# EAGLE design H1DR51 (EAGLE 9.6.1)

## Sheet 1 of 2
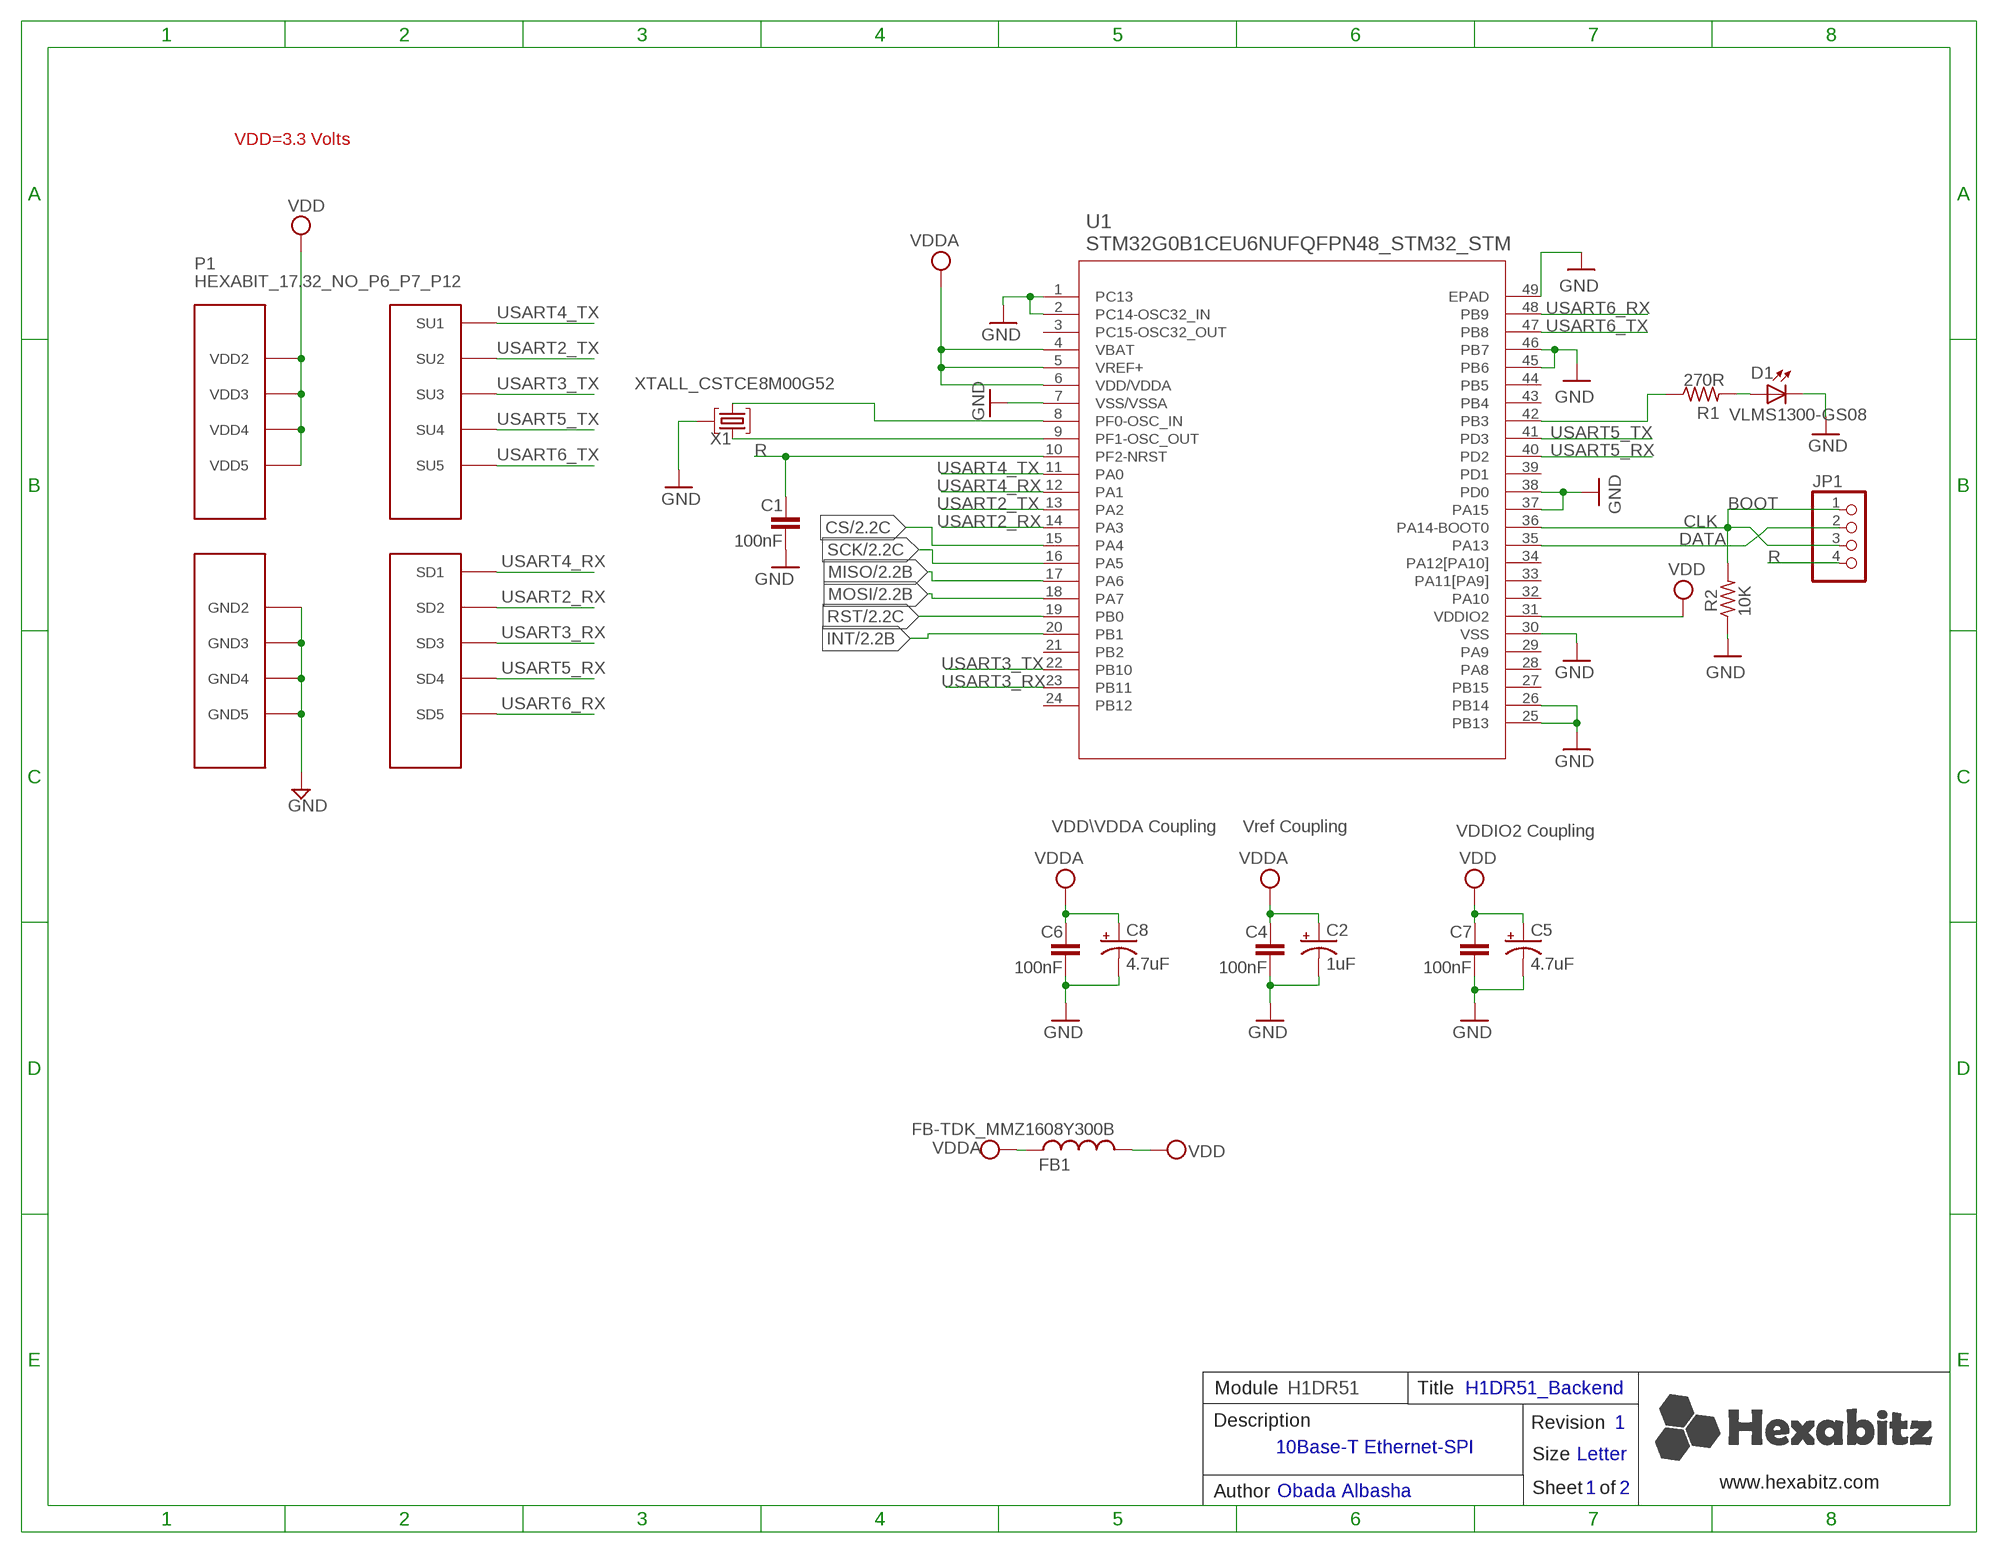
[diagram p0: schematic, sheet 1]

### Parts
C1  100nF  C-0603  [C-0603]
C2  1uF  C-0805-POL  [C-0805-POL]
C4  100nF  C-0603  [C-0603]
C5  4.7uF  C-0805-POL  [C-0805-POL]
C6  100nF  C-0603  [C-0603]
C7  100nF  C-0603  [C-0603]
C8  4.7uF  C-0805-POL  [C-0805-POL]
D1  VLMS1300-GS08  [VLMS1300-GS08]
FB1  FB-TDK_MMZ1608Y300B  [FB-TDK_MMZ1608Y300B]
JP1  PINHD-1X4  [1X04]
P1  HEXABIT_17.32_NO_P6_P7_P12  [HEXABIT_17.32_NO_P6_P7_P12]
R1  270R  R-0603  [R-0603]
R2  10K  R-0603  [R-0603]
U1  STM32G0B1CEU6NUFQFPN48_STM32_STM  [UFQFPN48_STM32_STM]
X1  XTALL_CSTCE8M00G52  [XTALL_CSTCE8M00G52]

### Nets
CLK: JP1.1 JP1.3 R2.2 U1.36(PA14-BOOT0)
CS: U1.15(PA4) ; also sheet 2
DATA: JP1.2 U1.35(PA13)
GND: C1.2 C2.2(-) C4.2 C5.2(-) C6.2 C7.2 C8.2(-) D1.C P1.PAD_PD8(GND2) P1.PAD_PD9(GND3) P1.PAD_PD10(GND4) P1.PAD_PD11(GND5) R2.1 U1.1(PC13) U1.2(PC14-OSC32_IN) U1.7(VSS/VSSA) U1.25(PB13) U1.26(PB14) U1.30(VSS) U1.37(PA15) U1.38(PD0) U1.45(PB6) U1.46(PB7) U1.49(EPAD) X1.P$2 ; also sheet 2
INT: U1.20(PB1) ; also sheet 2
MISO: U1.17(PA6) ; also sheet 2
MOSI: U1.18(PA7) ; also sheet 2
N$1: R1.1 U1.42(PB3)
N$3: D1.A R1.2
N$5: U1.9(PF1-OSC_OUT) X1.P$1
N$6: U1.8(PF0-OSC_IN) X1.P$3
R: C1.1 JP1.4 U1.10(PF2-NRST)
RST: U1.19(PB0) ; also sheet 2
SCK: U1.16(PA5) ; also sheet 2
USART2_RX: P1.PAD_PD5(SD2) U1.14(PA3)
USART2_TX: P1.PAD_PU5(SU2) U1.13(PA2)
USART3_RX: P1.PAD_PD1(SD3) U1.23(PB11)
USART3_TX: P1.PAD_PU1(SU3) U1.22(PB10)
USART4_RX: P1.PAD_PD4(SD1) U1.12(PA1)
USART4_TX: P1.PAD_PU4(SU1) U1.11(PA0)
USART5_RX: P1.PAD_PD2(SD4) U1.40(PD2)
USART5_TX: P1.PAD_PU2(SU4) U1.41(PD3)
USART6_RX: P1.PAD_PD3(SD5) U1.48(PB9)
USART6_TX: P1.PAD_PU3(SU5) U1.47(PB8)
VDD: C5.1(+) C7.1 FB1.2 P1.PAD_PU8(VDD2) P1.PAD_PU9(VDD3) P1.PAD_PU10(VDD4) P1.PAD_PU11(VDD5) U1.31(VDDIO2) ; also sheet 2
VDDA: C2.1(+) C4.1 C6.1 C8.1(+) FB1.1 U1.4(VBAT) U1.5(VREF+) U1.6(VDD/VDDA)
Unconnected: U1.3(PC15-OSC32_OUT) U1.21(PB2) U1.24(PB12) U1.27(PB15) U1.28(PA8) U1.29(PA9) U1.32(PA10) U1.33(PA11[PA9]) U1.34(PA12[PA10]) U1.39(PD1) U1.43(PB4) U1.44(PB5)

### Notes on the sheet
- VDD=3.3 Volts
- BOOT
- VDD\VDDA Coupling | Vref Coupling | VDDIO2 Coupling
- Module | H1DR51 | Title | H1DR51_Backend
- Description | Revision | 1
- 10Base-T Ethernet-SPI
- Size | Letter
- www.hexabitz.com
- Author | Obada Albasha | Sheet   of | 1 | 2
- C:/Users/Admin/Desktop/logodraft.bmp

## Sheet 2 of 2
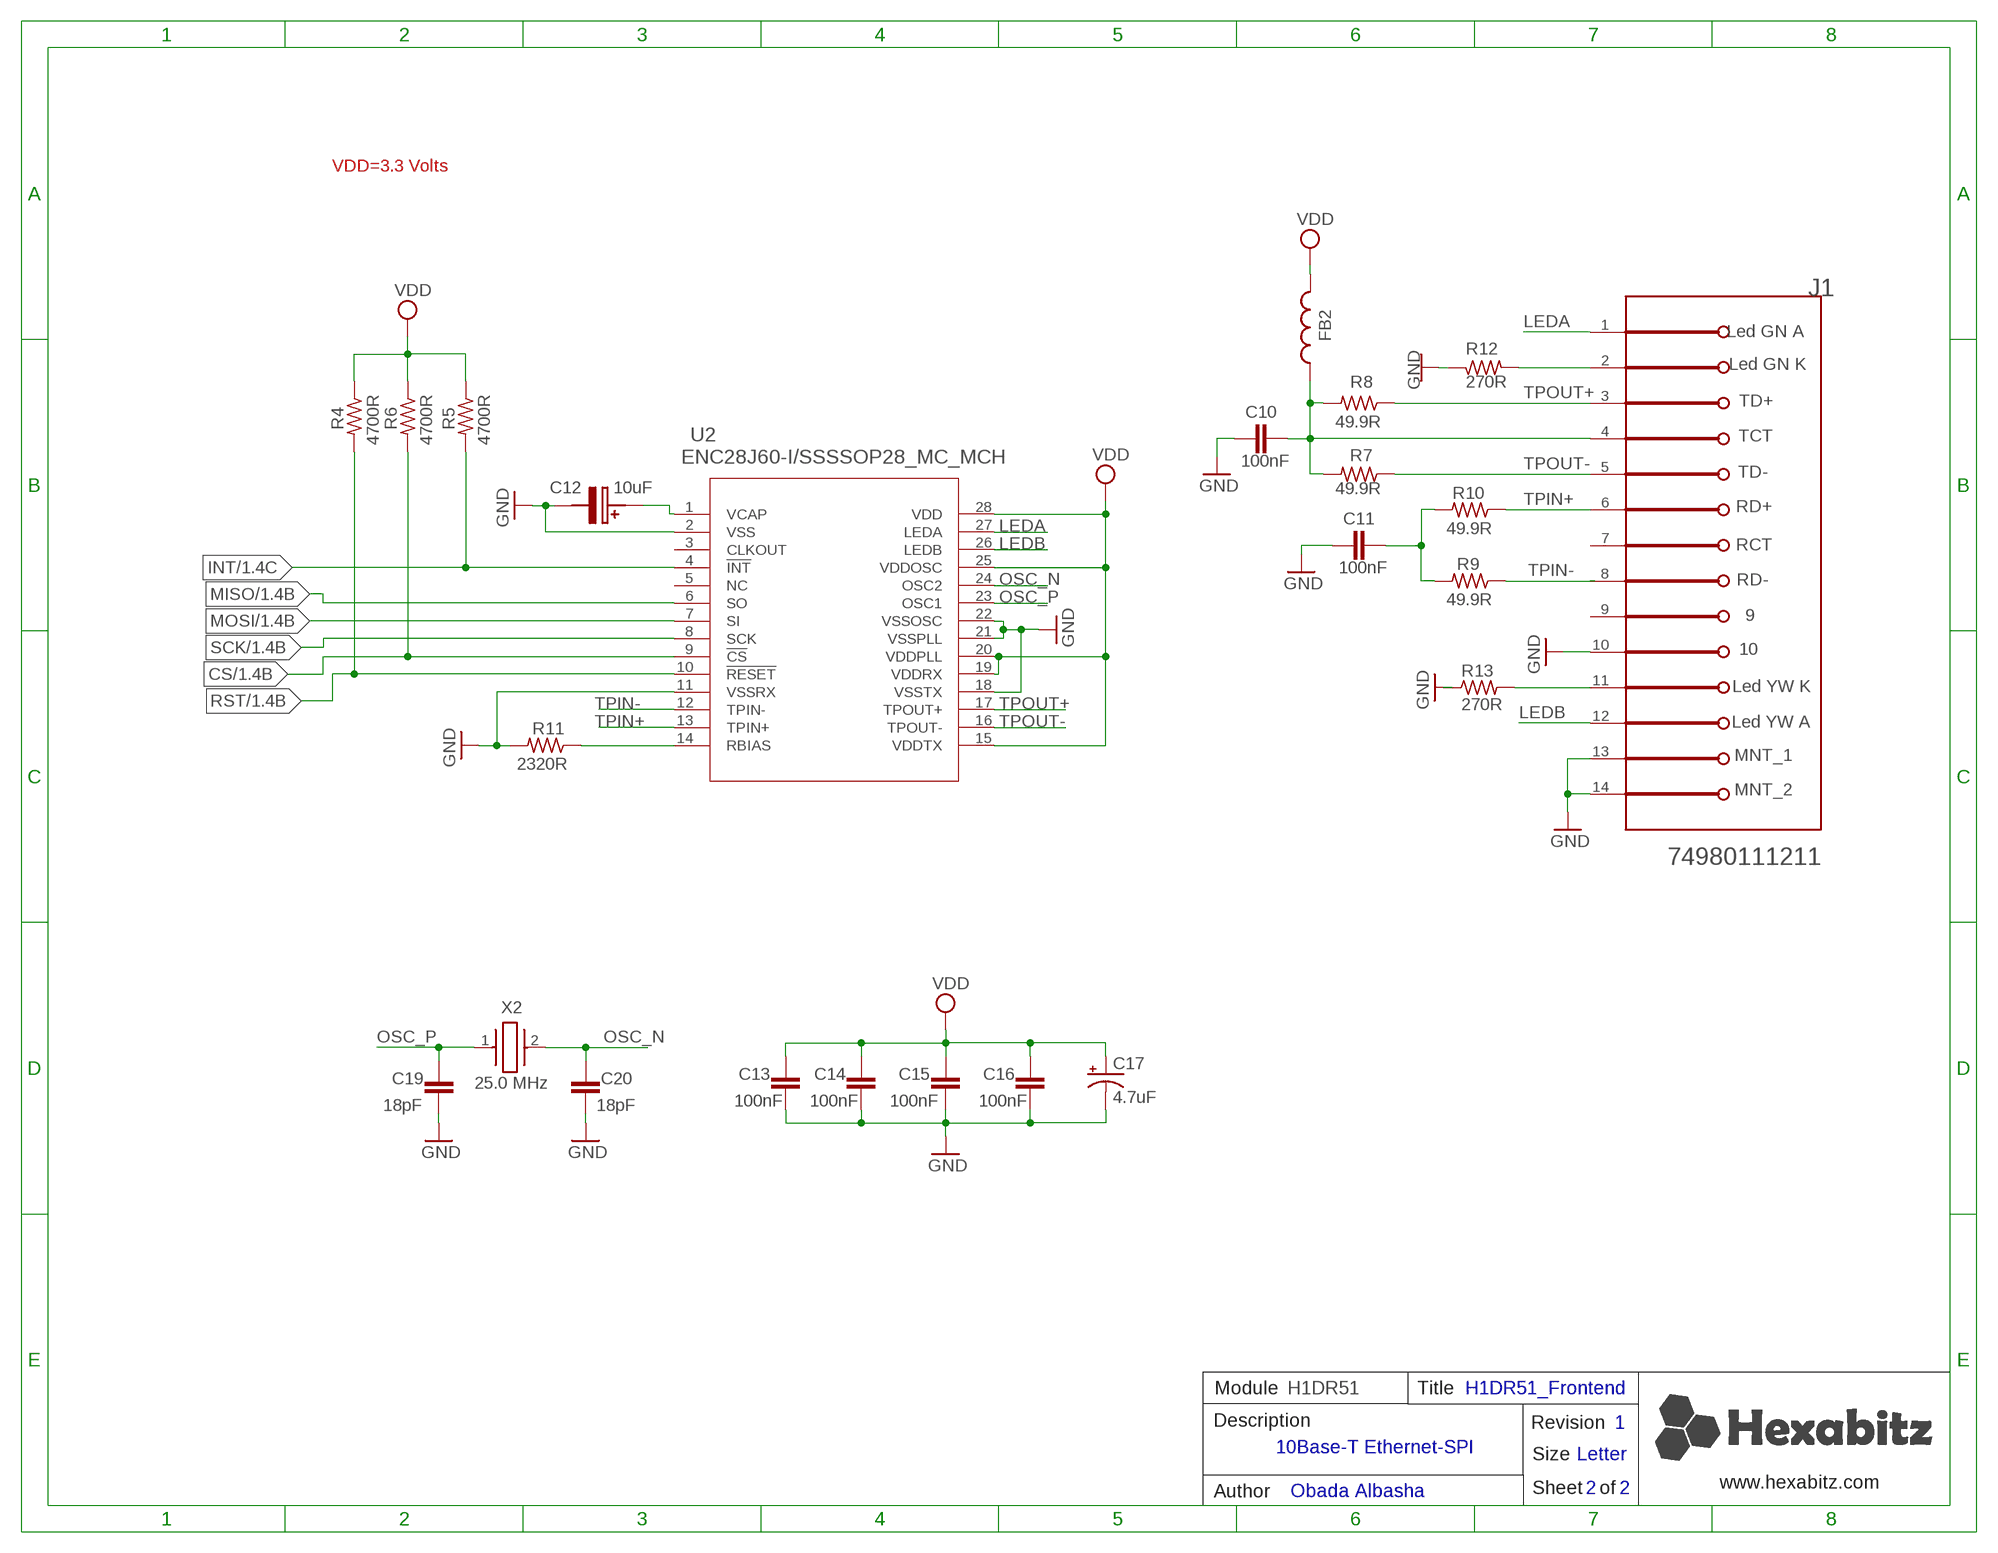
[diagram p1: schematic, sheet 2]

### Parts
C10  100nF  C-0603  [C-0603]
C11  100nF  C-0603  [C-0603]
C12  10uF  T491A106K010AT  [T491A]
C13  100nF  C-0603  [C-0603]
C14  100nF  C-0603  [C-0603]
C15  100nF  C-0603  [C-0603]
C16  100nF  C-0603  [C-0603]
C17  4.7uF  C-0805-POL  [C-0805-POL]
C19  18pF  C-0603  [C-0603]
C20  18pF  C-0603  [C-0603]
FB2  FB-TDK_MMZ1608Y300B  [FB-TDK_MMZ1608Y300B]
J1  WURTH_74980111211WURTH_74980111211_0_0  [WURTH_74980111211_0]
R4  4700R  R-0603  [R-0603]
R5  4700R  R-0603  [R-0603]
R6  4700R  R-0603  [R-0603]
R7  49.9R  R-0603  [R-0603]
R8  49.9R  R-0603  [R-0603]
R9  49.9R  R-0603  [R-0603]
R10  49.9R  R-0603  [R-0603]
R11  2320R  R-0603  [R-0603]
R12  270R  R-0603  [R-0603]
R13  270R  R-0603  [R-0603]
U2  ENC28J60-I/SSSSOP28_MC_MCH  [SSOP28_MC_MCH]
X2  25.0 MHz  ABM3-25.000MHZ-B2-T  [ABM325000MHZB2T]

### Nets
CS: R6.2 U2.9(!CS) ; also sheet 1
GND: C10.2 C11.2 C12.2(-) C13.2 C14.2 C15.2 C16.2 C17.2(-) C19.2 C20.2 J1.10 J1.13(MNT_1) J1.14(MNT_2) R11.2 R12.1 R13.1 U2.2(VSS) U2.11(VSSRX) U2.18(VSSTX) U2.21(VSSPLL) U2.22(VSSOSC) ; also sheet 1
INT: R5.2 U2.4(!INT) ; also sheet 1
LEDA: J1.1(GREEN_ANODE) U2.27(LEDA)
LEDB: J1.12(YELLOW_ANODE) U2.26(LEDB)
MISO: U2.6(SO) ; also sheet 1
MOSI: U2.7(SI) ; also sheet 1
N$2: C11.1 R9.2 R10.2
N$8: C10.1 FB2.1 J1.4(TCT) R7.2 R8.2
N$9: R11.1 U2.14(RBIAS)
N$10: C12.1(+) U2.1(VCAP)
N$11: J1.2(GREEN_CATHODE) R12.2
N$12: J1.11(YELLOW_CATHODE) R13.2
OSC_N: C20.1 U2.24(OSC2) X2.2
OSC_P: C19.1 U2.23(OSC1) X2.1
RST: R4.2 U2.10(!RESET) ; also sheet 1
SCK: U2.8(SCK) ; also sheet 1
TPIN+: J1.6(RD+) R10.1 U2.13(TPIN+)
TPIN-: J1.8(RD-) R9.1 U2.12(TPIN-)
TPOUT+: J1.3(TD+) R8.1 U2.17(TPOUT+)
TPOUT-: J1.5(TD-) R7.1 U2.16(TPOUT-)
VDD: C13.1 C14.1 C15.1 C16.1 C17.1(+) FB2.2 R4.1 R5.1 R6.1 U2.15(VDDTX) U2.19(VDDRX) U2.20(VDDPLL) U2.25(VDDOSC) U2.28(VDD) ; also sheet 1
Unconnected: J1.7(RCT) J1.9 U2.3(CLKOUT) U2.5(NC)

### Notes on the sheet
- VDD=3.3 Volts
- Module | H1DR51 | Title | H1DR51_Frontend
- Description | Revision | 1
- 10Base-T Ethernet-SPI
- Size | Letter
- www.hexabitz.com
- Author | Obada Albasha | Sheet   of | 2 | 2

## Library data of the parts
C1 C4 C6 C7 C10 C11 C13-C16 C19 C20 = HEXABITZ_RCLS:C-0603: CAP CER 10% X7R 0603
C2 C5 C8 C17 = HEXABITZ_RCLS:C-0805-POL: Cap Tant Solid SMD 2012
C12 = HEXABITZ_RCLS:T491A106K010AT: T491, Tantalum, MnO2 Tantalum, Commercial Grade, 10 uF, 10%, 10 VDC, 125?C, -55?C, 85?C, SMD, MnO2, Molded, 6 % , 3.8 Ohms, 1000 nA, 58.6 mg, 3216, 1.6mm, Height Max = 1.8mm, 2000, 156 Weeks Source: Datasheet <https://content.kemet.com/datasheets/KEM_T2005_T491.pdf>; DESCRIPTION: T491, Tantalum, MnO2 Tantalum, Commercial Grade, 10 uF, 10%, 10 VDC, 125?C, -55?C, 85?C, SMD, MnO2, Molded, 6 % , 3.8 Ohms, 1000 nA, 58.6 mg, 3216, 1.6mm, Height Max = 1.8mm, 2000, 156 Weeks; HEIGHT: 1.8mm; MANUFACTURER_NAME: KEMET; MANUFACTURER_PART_NUMBER: T491A106K010AT; MOUSER_PART_NUMBER: 80-T491A106K010; MOUSER_PRICE-STOCK: https://www.mouser.co.uk/ProductDetail/KEMET/T491A106K010AT?qs=VCf6WUQjPgE2CESwzh%252BRVg%3D%3D
D1 = Hexabitz:VLMS1300-GS08: Red 0603 130° Clear 54 mcd 2 V Surface Mount ChipLED ; Octopart Url : http://octopart.com/vlms1300-gs08-vishay-21709201; MFN: Vishay; MPN: VLMS1300-GS08; OCTOPART_URL: https://octopart.com/vlms1300-gs08-vishay-21709201?r=sp&s=_gcP4_q8T1SC6PJQPTQ9yA
FB1 FB2 = HEXABITZ_RCLS:FB-TDK_MMZ1608Y300B: Ferrite Beads Multi-Layer 30Ohm 25% 100MHz 1.5A 50mOhm DCR 0603; MFN: TDK; MPN: MMZ1608Y300B; OCTOPART_URL: https://octopart.com/mmz1608y300b-tdk-368280?r=sp&s=cd9_2ZEqQ9q9UNBuQgHAiA
J1 = HEXABITZ_CONNECTION_PARTS:WURTH_74980111211: Modular Connectors / Ethernet Connectors WE-RJ45 Intgtd XFMR 1X1 SMD Tab Up EMI; APPLICATIONS: 10/100 Base-T, AutoMDIX; CENTROID_NOT_SPECIFIED: No; DATASHEET: http://katalog.we-online.de/pbs/datasheet/74980111211.pdf; DIGIKEY_DESCRIPTION: CONN MAGJACK 1PORT 100 BASE-T; DIGIKEY_PART_NUMBER: 732-4517-1-ND; IS_FEMALE: yes; LEAD_FREE: yes; LED_COLOR: Yellow - Green; MF: Wurth; MOUSER_PART_NUMBER: 710-74980111211; MPN: 74980111211; PACKAGE: SMT_16MM1_25MM4; PREFIX: J; ROHS: yes; TEMPERATURE_RANGE_HIGH: +85°C; TEMPERATURE_RANGE_LOW: -40°C
JP1 = pinhead:PINHD-1X4: PIN HEADER
P1 = hexabitz_connectors:HEXABIT_?_NO_P6_P7_P12: Hexabitz Hexagon Module Connector Hexagon side length = 17.32mm. The following ports are removed: P6 P7 P12
R1 R2 R4-R13 = HEXABITZ_RCLS:R-0603: Thick Film Resistors - SMD 0603
U1 = HEXABITZ_ICs:STM32G0B1CEU6N; COPYRIGHT: Copyright (C) 2022 Ultra Librarian. All rights reserved.; MFN: STMicroelectronics; MPN: STM32G0B1CEU6N; OCTOPART_URL: https://app.ultralibrarian.com/details/c038d58b-752a-11eb-9033-0a34d6323d74/STMicroelectronics/STM32G0B1CEU6N?uid=116364672
U2 = HEXABITZ_ICs:ENC28J60-I/SS; COPYRIGHT: Copyright (C) 2022 Ultra Librarian. All rights reserved.; MANUFACTURER_PART_NUMBER: ENC28J60-I/SS; MFR_NAME: Microchip
X1 = Hexabitz:XTALL_CSTCE8M00G52: MURATA CSTCE8M00G52-R0 RESONATOR, SMD, 8MHZ ; Octopart Url : https://octopart.com/cstce8m00g52-r0-murata-7145559; MFN: Murata; MPN: CSTCE8M00G52Z-R0; OCTOPART_URL: https://octopart.com/cstce8m00g52z-r0-murata-17755941?r=sp&s=JDnNJnrHQhyS8Zk4ofFWXw
X2 = HEXABITZ_RCLS:ABM3-25.000MHZ-B2-T: Crystals +/-20ppm 25MHZ Source: Datasheet <https://datasheet.datasheetarchive.com/originals/distributors/SFDatasheet-0/sf-000246.pdf>; DESCRIPTION: Crystals +/-20ppm 25MHZ; HEIGHT: 1.3mm; MANUFACTURER_NAME: ABRACON; MANUFACTURER_PART_NUMBER: ABM3-25.000MHZ-B2-T; MOUSER_PART_NUMBER: 815-ABM3-25-B2-T; MOUSER_PRICE-STOCK: https://www.mouser.co.uk/ProductDetail/ABRACON/ABM3-25000MHZ-B2-T?qs=GgB7MJ%2FTIsQBQ7HNZGW3Hg%3D%3D

## Board
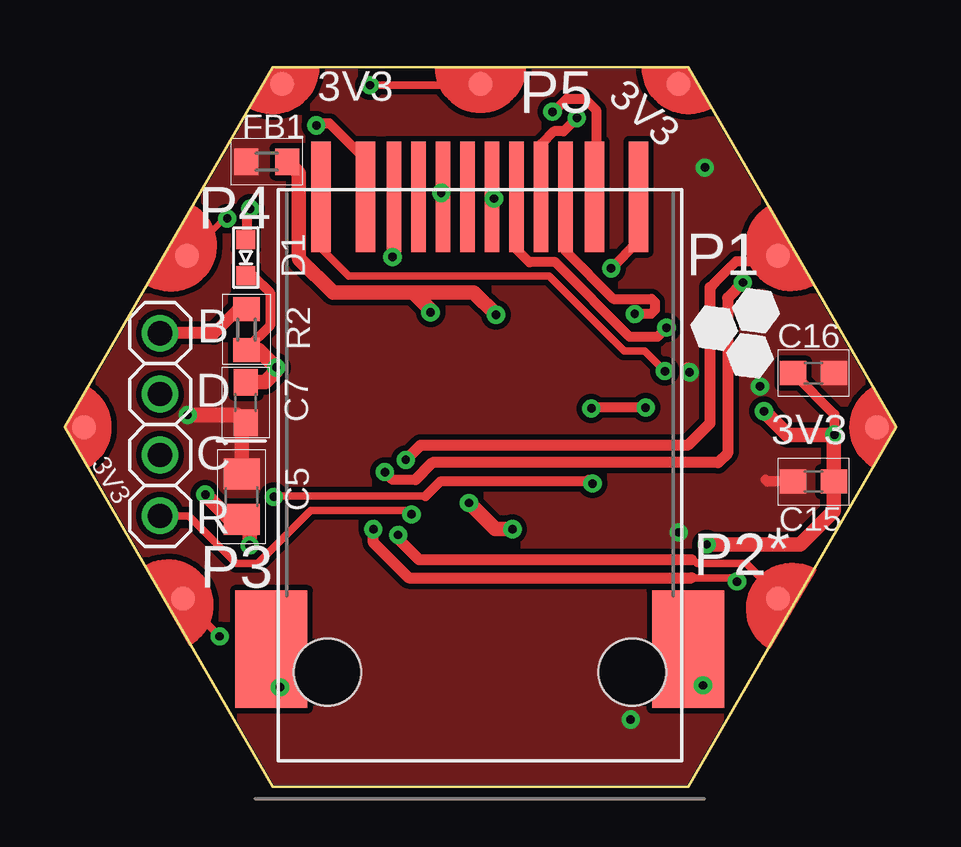
[diagram p2: board, top side]
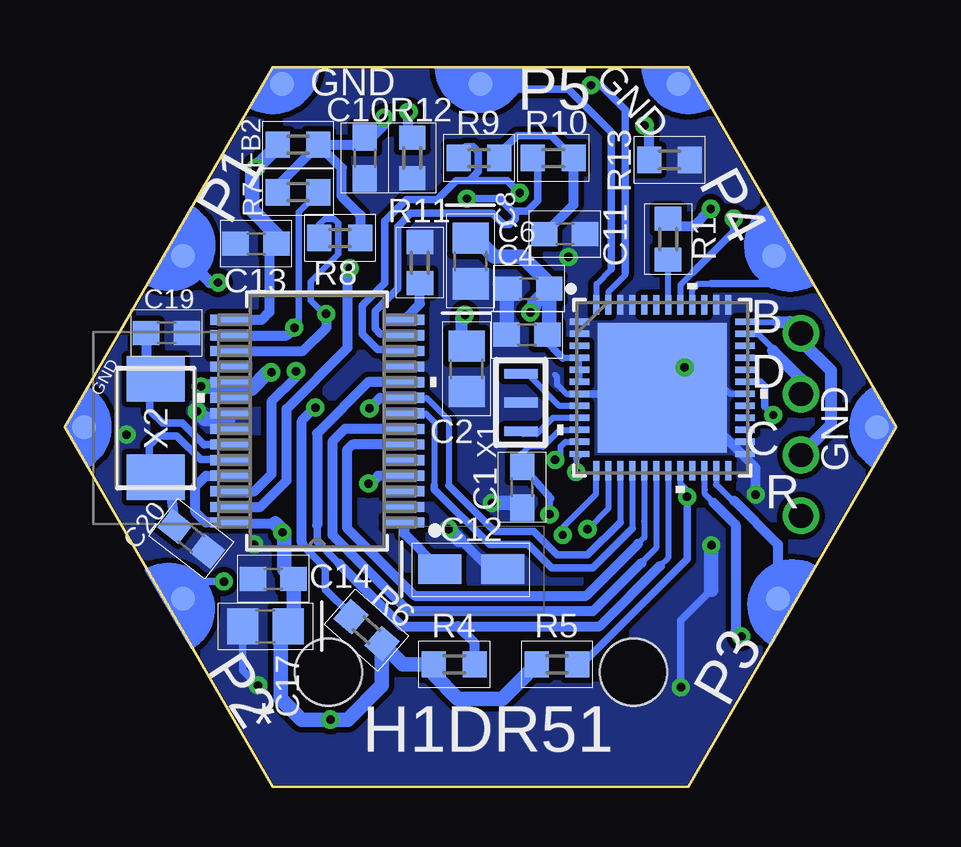
[diagram p3: board, bottom side, seen from below]

Size 34.64 x 30 mm. Coordinates in mm from the lower left corner, seen from the top.
Copper layers (1*16): Top 0.035mm / dielectric 1.5mm / Bottom 0.035mm
Design rules "Ibrahim *": minimum track width 6mil, minimum drill 0.35mm, track to track 9mil, track to pad 9mil, pad to pad 9mil, via to via 9mil, smd to smd 0mil, copper to edge 1mil, drill to drill 6mil, minimum pad ring 10mil, minimum via ring 8mil, stop-mask expansion 4mil, vias tented up to drill 24mil, thermal gap 10mil

### Footprints (pad centres in the part's own frame; a part is rotated, then mirrored left to right if it is on the bottom)
C-0603 = smd 1.1 x 1: 1 -0.85,0; 2 0.85,0
C-0805-POL = smd 1.3 x 1.5: 1 -0.95,0; 2 0.95,0
T491A = smd 1.8 x 1.23: 1 -1.31,0; 2 1.31,0
VLMS1300-GS08 = smd 0.8 x 0.8: A 0,0.75; C 0,-0.75
FB-TDK_MMZ1608Y300B = smd 1 x 1.1: 1 -0.85,0; 2 0.85,0
WURTH_74980111211_0 = smd 0.81 x 4.6: 1 -6.61,-12.397; 2 -4.77,-12.397; 11 4.77,-12.397; 12 6.61,-12.397 | smd 0.61 x 4.6: 3 -3.57,-12.397; 4 -2.55,-12.397; 5 -1.53,-12.397; 6 -0.51,-12.397; 7 0.51,-12.397; 8 1.53,-12.397; 9 2.55,-12.397; 10 3.57,-12.397 | smd 3 x 4.9: 13 -8.682,6.468; 14 8.682,6.468 | hole 2.8: -6.35,7.42; 6.35,7.42
1X04 = drill 1.016: 1 -3.81,0; 2 -1.27,0; 3 1.27,0; 4 3.81,0
HEXABIT_17.32_NO_P6_P7_P12 = smd 1 x 1 bottom: PAD_PD1 12.39,7.15; PAD_PD2 12.231,-7.15; PAD_PD3 0,-14.31; PAD_PD4 -12.39,-7.15; PAD_PD5 -12.39,7.15; PAD_PD8 16.52,0; PAD_PD9 8.26,-14.31; PAD_PD10 -8.26,-14.31; PAD_PD11 -16.52,0 | smd 1 x 1: PAD_PU1 12.39,7.15; PAD_PU2 12.231,-7.15; PAD_PU3 0,-14.31; PAD_PU4 -12.39,-7.15; PAD_PU5 -12.39,7.15; PAD_PU8 16.52,0; PAD_PU9 8.26,-14.31; PAD_PU10 -8.26,-14.31; PAD_PU11 -16.52,0
R-0603 = smd 1 x 1.1: 1 -0.85,0; 2 0.85,0
UFQFPN48_STM32_STM = smd 0.813 x 0.254: 1 -3.454,2.751; 2 -3.454,2.251; 3 -3.454,1.75; 4 -3.454,1.25; 5 -3.454,0.75; 6 -3.454,0.25; 7 -3.454,-0.25; 8 -3.454,-0.75; 9 -3.454,-1.25; 10 -3.454,-1.75; 11 -3.454,-2.251; 12 -3.454,-2.751; 25 3.454,-2.751; 26 3.454,-2.251; 27 3.454,-1.75; 28 3.454,-1.25; 29 3.454,-0.75; 30 3.454,-0.25; 31 3.454,0.25; 32 3.454,0.75; 33 3.454,1.25; 34 3.454,1.75; 35 3.454,2.251; 36 3.454,2.751 | smd 0.254 x 0.813: 13 -2.751,-3.454; 14 -2.251,-3.454; 15 -1.75,-3.454; 16 -1.25,-3.454; 17 -0.75,-3.454; 18 -0.25,-3.454; 19 0.25,-3.454; 20 0.75,-3.454; 21 1.25,-3.454; 22 1.75,-3.454; 23 2.251,-3.454; 24 2.751,-3.454; 37 2.751,3.454; 38 2.251,3.454; 39 1.75,3.454; 40 1.25,3.454; 41 0.75,3.454; 42 0.25,3.454; 43 -0.25,3.454; 44 -0.75,3.454; 45 -1.25,3.454; 46 -1.75,3.454; 47 -2.251,3.454; 48 -2.751,3.454 | smd 5.385 x 5.385: 49 0,0
SSOP28_MC_MCH = smd 1.664 x 0.432: 1 -3.626,4.225; 2 -3.626,3.575; 3 -3.626,2.925; 4 -3.626,2.275; 5 -3.626,1.625; 6 -3.626,0.975; 7 -3.626,0.325; 8 -3.626,-0.325; 9 -3.626,-0.975; 10 -3.626,-1.625; 11 -3.626,-2.275; 12 -3.626,-2.925; 13 -3.626,-3.575; 14 -3.626,-4.225; 15 3.626,-4.225; 16 3.626,-3.575; 17 3.626,-2.925; 18 3.626,-2.275; 19 3.626,-1.625; 20 3.626,-0.975; 21 3.626,-0.325; 22 3.626,0.325; 23 3.626,0.975; 24 3.626,1.625; 25 3.626,2.275; 26 3.626,2.925; 27 3.626,3.575; 28 3.626,4.225
XTALL_CSTCE8M00G52 = smd 1.4 x 0.4: P$1 0,1.2; P$2 0,0; P$3 0,-1.2
ABM325000MHZB2T = smd 1.9 x 2.4: 1 -2.05,0; 2 2.05,0

### Placement (x,y rotation side)
C1  15.59,12.5 270 bottom
C2  17.9,17.43 270 bottom
C4  15.38,18.85 180 bottom
C5  7.36,12.1 270 top
C6  15.3,20.78 180 bottom
C7  7.54,16.03 90 top
C8  17.73,21.93 270 bottom
C10  22.15,26.22 270 bottom
C11  13.81,23.05 0 bottom
C12  17.7,9.08 0 bottom
C13  26.67,22.65 180 bottom
C14  25.96,8.68 180 bottom
C15  31.19,12.73 0 top
C16  31.19,17.25 180 top
C17  26.27,6.7 180 bottom
C19  30.4,18.92 0 bottom
C20  29.37,10.35 322.2 bottom
D1  7.54,22.07 0.2 top
FB1  8.41,26.06 180 top
FB2  24.92,26.78 180 bottom
J1  17.29,12.21 180 top
JP1  3.97,15.11 270 top
P1  17.32,15 180 top
R1  9.5,22.84 90 bottom
R2  7.57,19.07 90 top
R4  18.42,5.11 0 bottom
R5  14.13,5.11 0 bottom
R6  22.07,6.54 138.8 bottom
R7  24.92,24.79 180 bottom
R8  23.18,22.89 0 bottom
R9  17.38,26.22 0 bottom
R10  14.29,26.22 0 bottom
R11  19.84,21.86 90 bottom
R12  20.16,26.22 90 bottom
R13  9.45,26.14 180 bottom
U1  9.75,16.64 0 bottom
U2  24.13,15.25 180 bottom
X1  15.64,16.03 180 bottom
X2  30.85,14.96 270 bottom

### Tracks (layer width: path | path; a pad name or v marks a point on that pad's centre or on a via)
CLK
  Top 0.305: R2.2 7.6,19.95
  Top 0.508: R2.2 7.22,19.92 6.22,18.92 JP1.1
  Bottom 0.254: U1.36 4.93,19.39
  Bottom 0.508: 4.93,19.39 4.44,19.39 JP1.1 3.97,18.62 2.72,17.37 2.72,15.09 JP1.3
CS  (via drill 0.35)
  Top 0.406: v24.2,15.81 v24.19,15.82 21.99,15.82 v21.94,15.78
  Bottom 0.254: 18.65,12.57 18.65,15.27 18.65,15.29 18.65,15.3 19.57,16.23 U2.9 | U1.15 11.5,11.03 11.51,11.02
  Bottom 0.305: 11.51,11.02 12.86,9.67 14.13,9.67 15.1,10.64 16.72,10.64 18.65,12.57 | R6.2 22.71,7.17 23.78,8.25 23.78,9.13 24.66,10.02 24.66,10.09 24.77,10.19
  Bottom 0.406: 24.77,10.19 24.77,15.27 24.22,15.81 v24.2,15.81 | U2.9 21.51,16.22 21.94,15.79 v21.94,15.78
DATA
  Bottom 0.254: U1.35 6.28,18.87 5.74,18.87 5.13,18.27 5.13,18.18
  Bottom 0.508: 5.13,18.18 3.97,17.02 JP1.2
GND  (via drill 0.35)
  Top 0.305: J1.13 26.59,5.13 v26.59,4.24 | J1.14 8.61,4.51 v8.97,4.16
  Top 0.406: C15.2 32.07,12.75 | J1.10 13.65,24.53 v13.65,22.1 | C16.2 32.07,15.53 v32.07,14.69 | R2.1 7.57,18.26 8.55,19.25 8.55,20.6 7.84,21.32 D1.C
  Top 0.61: R2.1 8.08,18.22 v8.81,17.49 8.81,17.33 8.35,16.88 C7.2 | v7.7,10.08 7.7,10.81 C5.2 6.9,11.15 v5.86,12.19 | v18.65,10.75 17.94,10.75 v16.84,11.84 | 32.05,14.67 C15.2 32.05,11.52 30.64,10.11 v26.75,10.11 | 32.05,14.67 v32.07,14.69 | v29.13,15.67 30.13,14.67 32.05,14.67
  Bottom 0.254: 6.28,16.38 U1.30 6.92,16.39 7.17,16.64 9.21,16.64 9.68,16.64 U1.49 | 14.21,17.17 14.13,17.1 14.13,16.78 13.74,16.39 13.57,16.39
  Bottom 0.305: 9.68,16.64 9.93,16.39 U1.7 13.57,16.39 | v26.59,4.24 27.22,4.87 C17.2 | v8.97,4.16 8.97,6.94 7.7,8.21 7.62,8.28
  Bottom 0.356: 18.21,10.31 18.08,10.18 18.02,10.18 16.92,9.08 C12.2
  Bottom 0.406: v13.65,22.1 13.73,22.18 | C4.2 16.23,18.58 16.39,18.73 | v5.86,12.19 5.86,13.29 9.21,16.64
  Bottom 0.61: U1.49 8.9,17.49 v8.81,17.49 | C1.2 15.78,11.84 v16.84,11.84 | v18.65,10.75 18.21,10.31 | 16.23,19.08 C4.2 16.23,20.7 16.39,20.54 16.39,20.86 16.51,20.98 | 17.76,16.48 C2.2 17.82,16.4 | v7.7,10.08 7.7,8.21 | v29.13,15.67 28.81,15.35 27.82,15.35
  pour Bottom (no thermals): 26,30.1 8.65,30.1 0,15.12 8.66,0.12 26.06,0.12 34.69,15.06
INT  (via drill 0.35)
  Top 0.305: 15.03,12.12 8.74,12.12 v8.71,12.09
  Top 0.406: 21.83,12.81 v21.99,12.65 21.91,12.73 15.64,12.73 15.03,12.12
  Bottom 0.254: U1.20 8.98,13.17 8.98,12.63 8.71,12.36 v8.71,12.09 | R5.2 13.21,5.04
  Bottom 0.305: v8.71,12.09 8.71,9.5 13.1,5.11 R5.2
  Bottom 0.406: U2.4 21.58,12.98 21.91,12.65 v21.99,12.65
LEDA  (via drill 0.35)
  Top 0.406: J1.1 23.89,24.59 23.89,22.75 v22.77,21.62
  Bottom 0.406: U2.27 26.49,11.68 25.4,12.77 25.4,15.76 22.86,18.3 22.86,21.52 v22.77,21.62
LEDB  (via drill 0.35)
  Top 0.305: v25,17.33 24.16,18.18 23.31,18.18 20.2,21.29 11.84,21.29 10.56,22.57 10.56,24.48 | 10.6,23.21 10.56,23.21
  Top 0.406: 10.56,23.21 10.56,24.48 J1.12
  Bottom 0.406: U2.26 26.74,12.33 26.03,13.03 26.03,16.06 25,17.1 v25,17.33
MISO
  Bottom 0.254: U1.17 10.5,11.08 10.49,11.07 10.49,10.4 10.75,10.14
  Bottom 0.406: U2.6 22.66,14.28 22.86,14.08 22.86,10.77 20.06,7.97 12.92,7.97 10.75,10.14
MOSI
  Bottom 0.254: 10.61,9.34 10,9.96 U1.18
  Bottom 0.406: U2.7 22.97,14.93 23.49,14.4 23.49,10.51 20.32,7.33 12.62,7.33 10.61,9.34
N$1
  Bottom 0.254: U1.42 R1.1
N$2
  Bottom 0.305: R10.2 14.37,27.16 15.8,27.16 16.53,26.42 R9.2
  Bottom 0.406: C11.1 13.44,24.27 R10.2
N$3  (via drill 0.35)
  Top 0.406: D1.A 7.58,22.86 7.58,23.96 v7.72,24.1
  Bottom 0.406: R1.2 9.2,23.39 8.44,23.39 v7.72,24.1
N$5
  Bottom 0.254: X1.P$1 15.53,14.71 14.98,14.71 14.31,15.39 U1.9
N$6
  Bottom 0.254: X1.P$3 15.37,17.23 14.04,15.89 U1.8
N$8  (via drill 0.35)
  Top 0.406: v21.33,27.89 20.78,27.34 20.38,27.34 19.84,26.8 J1.4
  Bottom 0.406: 22.28,22.7 22.33,22.74 R8.2 22.33,23.84 23.1,24.61 23.1,25.8 23.97,26.67 24.18,26.67 | 24.18,26.67 FB2.1 22.44,26.78 C10.1 21.85,27.07 21.33,27.59 v21.33,27.89 | 24.18,26.67 25.77,25.08 R7.2
N$9
  Bottom 0.406: U2.14 19.84,20.13 R11.1
N$10
  Bottom 0.406: U2.1 20.5,10.57 C12.1
N$11  (via drill 0.35)
  Top 0.406: v20.32,28.15 20.37,28.15 20.92,28.7 21.67,28.7 22.14,28.23 22.14,24.69 J1.2
  Bottom 0.406: R12.2 20.32,27.23 v20.32,28.15
N$12  (via drill 0.35)
  Top 0.406: v10.48,27.58 10.56,27.66 11.04,27.66 12.46,26.23 12.46,24.67 J1.11
  Bottom 0.406: R13.2 10.3,27.39 v10.48,27.58
OSC_N
  Bottom 0.254: U2.24 27.79,13.66 | 31.35,13.29 31.35,12.89 30.88,12.89 X2.2
  Bottom 0.305: 27.79,13.66 27.81,13.64 28.97,13.64 29.96,14.63 30.72,14.63 31.12,14.24 31.12,13.47 30.85,13.21
  Bottom 0.406: 30.85,13.63 30.85,13.21 X2.2 30.21,12.27 C20.1
OSC_P
  Bottom 0.254: 29.92,16.78 30.16,17.01 X2.1
  Bottom 0.305: U2.23 28.83,14.28 28.81,14.26 28.83,14.26 29.74,15.17 30.56,15.17 31.09,15.7 31.09,17.01
  Bottom 0.406: C19.1 31.25,17.41 31.09,17.25 | 31.09,17.25 31.09,17.01 31.17,17.09 31.01,17.25 30.4,17.25 | 31.09,17.25 X2.1
R  (via drill 0.35)
  Top 0.305: v14.45,11.36 14.29,11.52 10.24,11.52 8.03,9.32 7.14,9.32 5.16,11.3 JP1.4
  Bottom 0.254: U1.10 14.01,14.89 14.71,14.19 15.28,14.19 15.59,13.89
  Bottom 0.305: v14.45,11.36 14.45,11.99 14.39,12.03 15.25,13.01 C1.1 15.59,13.89
RST
  Bottom 0.254: 9.84,9.21 9.5,9.56 U1.19
  Bottom 0.305: 24.13,10.9 24.13,10.24 23.19,9.3
  Bottom 0.406: 9.84,9.21 12.36,6.7 18.26,6.7 | U2.10 22,16.87 24.13,14.74 24.13,10.9 | 23.19,9.3 20.59,6.7 18.26,6.7 | R4.2 17.56,6.01 18.26,6.7
SCK
  Bottom 0.254: U1.16 11,10.78 | U2.8 19.6,15.58 19.24,15.22 19.24,12.57
  Bottom 0.305: 11,10.78 12.64,9.13 14.35,9.13 15.32,10.11 16.94,10.11 19.24,12.41 19.24,12.57
TPIN+  (via drill 0.35)
  Top 0.305: J1.6 v17.88,24.53
  Bottom 0.305: U2.13 20.55,18.88 21.49,18.88 21.71,19.1 21.71,19.85 20.77,20.79 20.77,23.37 20.22,23.92 16.83,23.92 16.35,23.45 16.11,23.45 15.88,23.68 15.88,23.88 16,24.01 | R10.1 14.92,26.01 14.92,24.45 15.37,24.01 16,24.01 | v17.88,24.53 16.52,24.53 16,24.01
  Bottom 0.406: U2.13
TPIN-  (via drill 0.35)
  Top 0.305: J1.8 15.77,24.69 v15.68,24.77
  Bottom 0.254: R9.1 18.23,25.91
  Bottom 0.305: U2.12 20.55,18.23 21.59,18.23 22.25,18.88 22.25,20.07 21.31,21.01 21.31,23.59 20.4,24.49 19.13,24.49 18.34,25.29 17.78,25.29 | 18.23,25.95 R9.1 18.32,26.31 | 17.78,25.29 16.21,25.29 v15.68,24.77 | 17.78,25.29 17.41,25.65 17.41,26.49 17.62,26.7 17.94,26.7 18.32,26.31 | 18.49,26.62 18.56,26.55 18.32,26.31
TPOUT+  (via drill 0.35)
  Top 0.406: J1.3 20.87,22.35 22.86,20.35 24.45,20.35 24.59,20.21 24.59,19.89 24.42,19.72 v23.75,19.72
  Bottom 0.279: 23.83,19.72 24.39,20.28 24.39,21.07 23.24,22.21 23.24,23.51 23.42,23.68 23.81,23.68 24.03,23.47 R8.1
  Bottom 0.305: v23.75,19.72 23.83,19.72
  Bottom 0.406: U2.17 24.72,18.18 23.73,19.16 23.73,19.71 v23.75,19.72
TPOUT-  (via drill 0.35)
  Top 0.406: v25.07,19.15 24.69,18.76 23.55,18.76 20.44,21.87 19.36,21.87 18.82,22.41 18.81,22.41 18.81,24.59 J1.5
  Bottom 0.279: R7.1 24.9,23.97 24.9,19.32 v25.07,19.15
  Bottom 0.406: U2.16 25.39,18.83 v25.07,19.15 | R7.1 24.07,24.67 24.09,24.67 24.09,24.66
USART2_RX  (via drill 0.35)
  Top 0.305: 26.12,8.72 27.85,8.72 v28.01,8.56
  Top 0.457: 26.12,8.72 14.33,8.72 12.86,10.19 v12.86,10.75
  Bottom 0.254: v12.86,10.75 11.99,11.62 11.99,13.17 U1.14
  Bottom 0.305: v28.01,8.56 29,8.56 P1.PAD_PD5
USART2_TX  (via drill 0.35)
  Top 0.305: 29.71,8.01 28.4,9.32 26.35,9.32 26.19,9.48 26.12,9.48
  Top 0.356: P1.PAD_PU5 29.71,8.01
  Top 0.457: v13.89,10.51 13.89,10.35 14.76,9.48 26.12,9.48
  Bottom 0.254: v13.89,10.51 13.89,10.82 12.5,12.22 U1.13
USART3_RX
  Bottom 0.254: U1.23 7.5,12.61 6.83,11.94 6.75,11.94
  Bottom 0.305: 4.93,8.52 P1.PAD_PD1
  Bottom 0.406: 6.75,11.94 4.93,10.12 4.93,8.52
USART3_TX  (via drill 0.35)
  Top 0.305: v6.45,6.28 4.93,7.8 P1.PAD_PU1
  Bottom 0.254: 7.62,11.86 7.97,12.21 7.97,12.4 7.98,12.41 7.98,13.17 U1.22
  Bottom 0.406: 7.62,11.86 6.69,10.92 6.69,6.52 v6.45,6.28
USART4_RX  (via drill 0.35)
  Top 0.406: 14.61,12.81 13.65,12.81 v13.34,13.13
  Top 0.457: v28.25,21.03 27.62,20.39 27.62,13.91 27.23,13.52 15.32,13.52 14.61,12.81
  Bottom 0.254: v13.34,13.13 13.34,13.68 13.2,13.82 U1.12
  Bottom 0.406: 28.59,21.03 v28.25,21.03
  Bottom 0.457: P1.PAD_PD4 28.59,21.03
USART4_TX  (via drill 0.35)
  Top 0.356: 27.12,21.06 27.1,21.06
  Top 0.406: P1.PAD_PU4 29.48,21.92 27.98,21.92 27.12,21.06 26.88,20.83
  Top 0.457: 26.88,20.83 26.88,15.17 25.96,14.24 14.81,14.24 v14.21,13.64
  Bottom 0.254: v14.21,13.64 14.02,13.64 13.98,13.68 13.98,14.2 13.79,14.39 U1.11
USART5_RX
  Bottom 0.254: U1.40 8.5,20.74 8.25,20.98 7.7,20.98
  Bottom 0.305: 7.7,20.98 5.16,20.98 | 4.76,21.38 4.76,21.82 P1.PAD_PD2
  Bottom 0.406: 5.16,20.98 4.76,21.38
USART5_TX  (via drill 0.35)
  Top 0.254: v6.77,23.7 6.64,23.7 5.18,22.24
  Top 0.305: 5.35,22.41 5.18,22.24 P1.PAD_PU2
  Bottom 0.254: U1.41 8.98,20.11 8.98,20.94 8.45,21.47
  Bottom 0.305: 8.45,21.47 6.77,23.15 v6.77,23.7
USART6_RX
  Bottom 0.254: U1.48 12.48,20.11 12.48,20.97 11.86,21.59
  Bottom 0.305: P1.PAD_PD3 17.09,29.08 13.65,29.08 11.86,27.29 11.86,21.59
USART6_TX  (via drill 0.35)
  Top 0.305: P1.PAD_PU3 17.27,29.26 v12.71,29.26
  Bottom 0.254: U1.47 11.98,20.11 11.98,20.65 11.28,21.35 11.28,21.45
  Bottom 0.305: 11.28,21.45 11.28,28.24 12.3,29.26 v12.71,29.26
VDD  (via drill 0.35)
  Top 0.406: C15.1 29.29,12.73 29.2,12.82
  Top 0.61: v5.12,15.51 7.21,15.51 C7.1 7.36,15 C5.1 | v26.03,17.29 26.03,17.33 25.96,17.41
  Bottom 0.254: U1.31 | U1.31 5.67,16.89 | 5.48,15.86 v5.12,15.51
  Bottom 0.305: 5.67,16.89 5.48,16.7 5.48,15.86
  Bottom 0.406: U2.20 27.75,16.62 27.75,16.7 U2.19 | 27.74,11.03 U2.28 | U2.28 28.76,11.03 29.2,11.47 29.2,12.53 28.76,12.97 U2.25 | C14.1 25.5,9.08 | 26,22.34 C13.1 26.12,22.35 26.12,20.4 26.12,19.8 26.44,19.48 U2.15 | U2.28 27.71,10.98 25.88,10.98
  Bottom 0.61: 25.5,10.61 25.88,10.98 | 25.5,9.08 25.5,10.61 | C14.1 25.11,6.91 C17.1 25.64,6.38 25.64,3.68 24.77,2.81 v23.58,2.81 22.86,2.81 21.43,4.24 R6.1 20.56,5.11 R4.1 19.27,4.69 18.26,3.68 16.41,3.68 R5.1 | v26.03,17.29 26.19,17.29 26.86,16.62 27.75,16.62 | C13.1 25.82,23.04 26.83,24.05 26.83,25.67 v26.67,25.83 25.77,26.72 FB2.2 | 25.5,10.61 v25.58,10.61 | v28.97,16.7 27.75,16.7
  pour Top (no thermals): 26.06,30.1 8.63,30.1 0.03,15.14 8.67,0.09 25.99,0.12 34.68,15.17
VDDA  (via drill 0.35)
  Top 0.61: FB1.1 9.75,25.58 9.75,22.09 9.76,22.07 9.76,22.02 11.18,20.6 14.53,20.6 | v17.97,19.69 17.05,20.6 14.53,20.6 | v15.24,19.78 15.24,19.89 14.53,20.6
  Bottom 0.254: 13.89,17.89 U1.4 U1.5 U1.6
  Bottom 0.305: 13.89,17.89 14.69,18.7 C4.1 | 14.69,18.77 14.45,19.01
  Bottom 0.508: C2.1 18.13,18.61 18.13,19.52 v17.97,19.69
  Bottom 0.559: C6.1 14.45,20.99 | 17.54,22.91 17.54,23.07 C8.1
  Bottom 0.61: 14.69,18.7 14.69,18.77 | 14.45,19.01 C6.1 | C4.1 14.59,18.85 | C6.1 14.45,20.75 | 17.54,22.91 16.75,22.11 15.57,22.11 14.45,20.99 | C6.1 15.07,20.16 15.07,20.06 15.24,19.89 v15.24,19.78

### Text on the board
tPlace: 3V3 | P5 | 3V3 | P4 | P1 | 3V3 | 3V3 | P3 | P2 | *
bPlace: P5 | GND | GND | P1 | P4 | GND | GND | P3 | P2 | H1DR51 | *
tNames: B | D | C | R
bNames: B | D | C | R